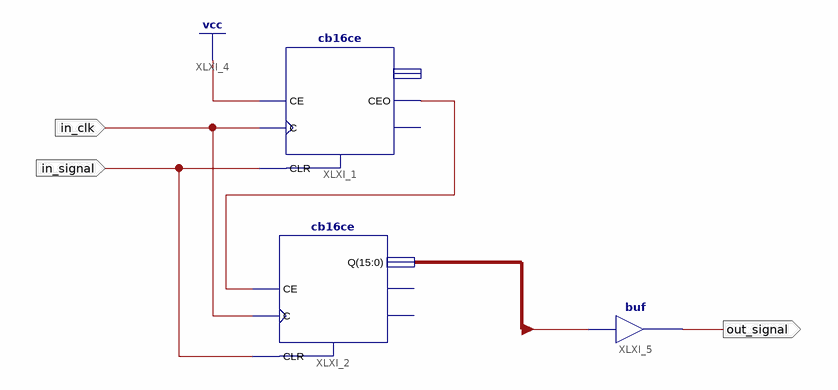
[diagram p0: schematic sheet 1]
// Xilinx ISE schematic debouncer.sch (aspartan6) as structural Verilog: 3 symbols, 3 ports
module debouncer (
  input  in_signal,
  input  in_clk,
  output out_signal
);

  wire XLXN_3;
  wire [15:0] db2;

  cb16ce XLXI_1 (.C(in_clk), .CE(1'b1), .CLR(in_signal), .CEO(XLXN_3));  // open: Q, TC
  cb16ce XLXI_2 (.C(in_clk), .CE(XLXN_3), .CLR(in_signal), .Q(db2));  // open: CEO, TC
  buf XLXI_5 (out_signal, db2[7]);
endmodule
